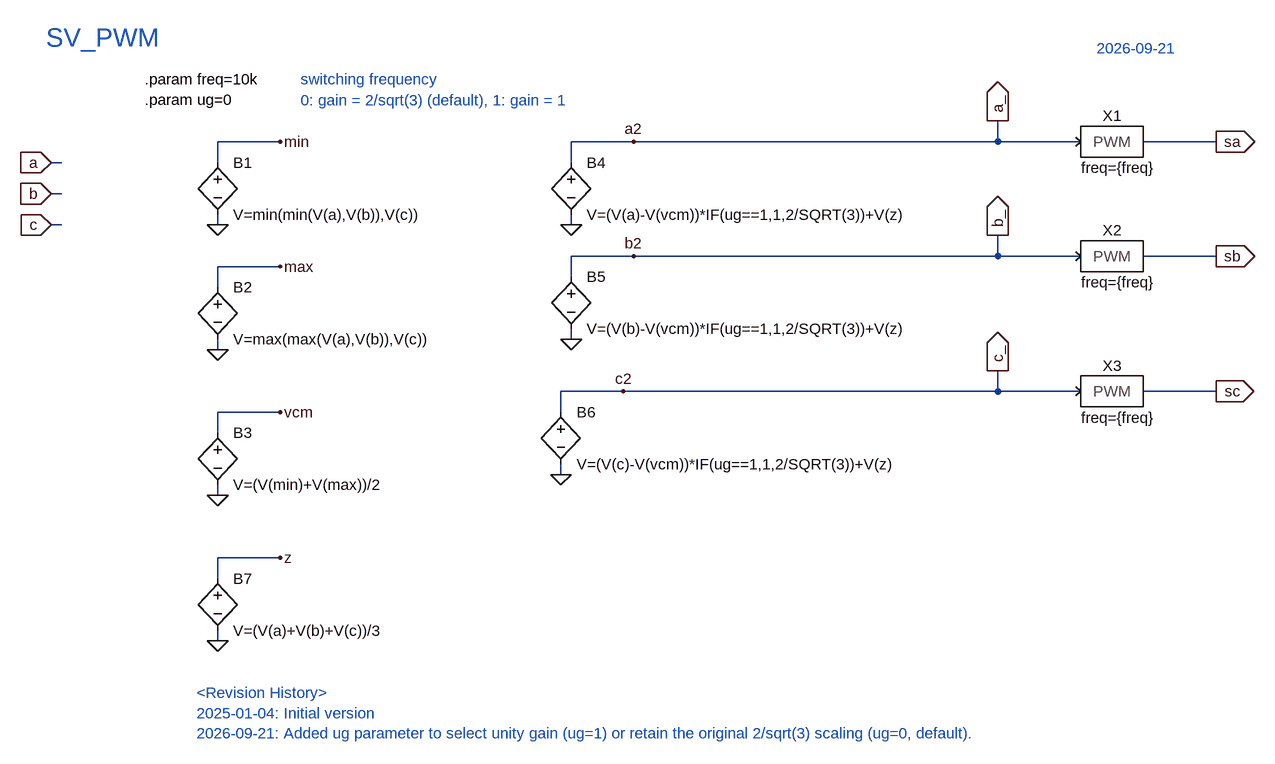
[diagram p0: schematic SV_PWM.asc]
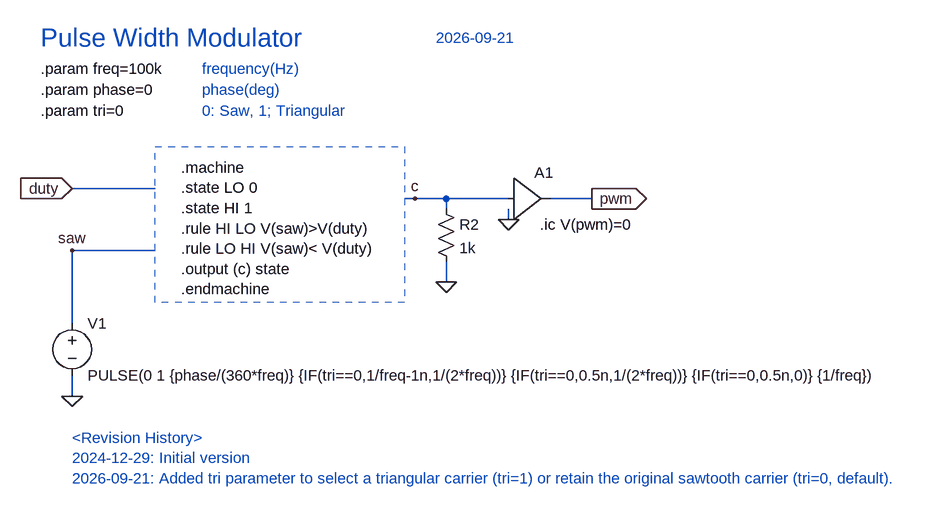
[diagram p1: sub-circuit pwm.asc]
SV_PWM.asc, the LTspice schematic file:
Version 4.1
SHEET 1 2540 1384
WIRE 720 464 624 464
WIRE 1264 464 1168 464
WIRE 1824 464 1824 432
WIRE 1824 464 1264 464
WIRE 1952 464 1824 464
WIRE 2160 464 2048 464
WIRE 384 496 368 496
WIRE 624 496 624 464
WIRE 1168 496 1168 464
WIRE 384 544 368 544
WIRE 384 592 368 592
WIRE 624 592 624 576
WIRE 1168 592 1168 576
WIRE 1264 640 1168 640
WIRE 1824 640 1824 608
WIRE 1824 640 1264 640
WIRE 1952 640 1824 640
WIRE 2160 640 2048 640
WIRE 720 656 624 656
WIRE 1168 672 1168 640
WIRE 624 688 624 656
WIRE 1168 768 1168 752
WIRE 624 784 624 768
WIRE 1248 848 1152 848
WIRE 1824 848 1824 816
WIRE 1824 848 1248 848
WIRE 1952 848 1824 848
WIRE 2160 848 2048 848
WIRE 720 880 624 880
WIRE 1152 880 1152 848
WIRE 624 912 624 880
WIRE 1152 976 1152 960
WIRE 624 1008 624 992
WIRE 720 1104 624 1104
WIRE 624 1136 624 1104
WIRE 624 1232 624 1216
FLAG 368 496 a
IOPIN 368 496 In
FLAG 368 544 b
IOPIN 368 544 In
FLAG 368 592 c
IOPIN 368 592 In
FLAG 624 592 0
FLAG 720 464 min
FLAG 624 784 0
FLAG 720 656 max
FLAG 624 1008 0
FLAG 720 880 vcm
FLAG 1168 592 0
FLAG 1264 464 a2
FLAG 1168 768 0
FLAG 1264 640 b2
FLAG 1152 976 0
FLAG 1248 848 c2
FLAG 624 1232 0
FLAG 720 1104 z
FLAG 2160 464 sa
IOPIN 2160 464 Out
FLAG 2160 640 sb
IOPIN 2160 640 Out
FLAG 2160 848 sc
IOPIN 2160 848 Out
FLAG 1824 432 a_
IOPIN 1824 432 Out
FLAG 1824 608 b_
IOPIN 1824 608 Out
FLAG 1824 816 c_
IOPIN 1824 816 Out
SYMBOL bv 624 480 R0
SYMATTR InstName B1
SYMATTR Value V=min(min(V(a),V(b)),V(c))
SYMBOL bv 624 672 R0
SYMATTR InstName B2
SYMATTR Value V=max(max(V(a),V(b)),V(c))
SYMBOL bv 624 896 R0
SYMATTR InstName B3
SYMATTR Value V=(V(min)+V(max))/2
SYMBOL bv 1168 480 R0
SYMATTR InstName B4
SYMATTR Value V=(V(a)-V(vcm))*IF(ug==1,1,2/SQRT(3))+V(z)
SYMBOL bv 1168 656 R0
SYMATTR InstName B5
SYMATTR Value V=(V(b)-V(vcm))*IF(ug==1,1,2/SQRT(3))+V(z)
SYMBOL bv 1152 864 R0
SYMATTR InstName B6
SYMATTR Value V=(V(c)-V(vcm))*IF(ug==1,1,2/SQRT(3))+V(z)
SYMBOL bv 624 1120 R0
SYMATTR InstName B7
SYMATTR Value V=(V(a)+V(b)+V(c))/3
SYMBOL PowerSim\\PWM 2000 464 R0
WINDOW 39 10 56 Bottom 2
SYMATTR SpiceLine freq={freq}
SYMATTR InstName X1
SYMBOL PowerSim\\PWM 2000 640 R0
WINDOW 39 10 56 Bottom 2
SYMATTR SpiceLine freq={freq}
SYMATTR InstName X2
SYMBOL PowerSim\\PWM 2000 848 R0
WINDOW 39 10 56 Bottom 2
SYMATTR SpiceLine freq={freq}
SYMATTR InstName X3
TEXT 360 304 Left 4 ;SV_PWM
TEXT 1976 320 Left 2 ;2026-09-21
TEXT 512 368 Left 2 !.param freq=10k\n.param ug=0
TEXT 752 368 Left 2 ;switching frequency
TEXT 752 400 Left 2 ;0: gain = 2/sqrt(3) (default), 1: gain = 1
TEXT 592 1312 Left 2 ;<Revision History>\n2025-01-04: Initial version\n2026-09-21: Added ug parameter to select unity gain (ug=1) or retain the original 2/sqrt(3) scaling (ug=0, default).

pwm.asc, the sub-circuit schematic file:
Version 4.1
SHEET 1 1668 1312
WIRE 32 64 -96 64
WIRE 432 80 416 80
WIRE 480 80 432 80
WIRE 576 80 480 80
WIRE 704 80 640 80
WIRE 480 96 480 80
WIRE 576 112 576 96
WIRE 32 160 -96 160
WIRE 480 208 480 176
WIRE -96 272 -96 160
WIRE -96 384 -96 352
FLAG -96 64 duty
IOPIN -96 64 In
FLAG 704 80 pwm
IOPIN 704 80 Out
FLAG 480 208 0
FLAG 432 80 c
FLAG 576 112 0
FLAG -96 384 0
FLAG -96 160 saw
SYMBOL res 464 80 R0
SYMATTR InstName R2
SYMATTR Value 1k
SYMBOL Digital\\buf1 576 16 R0
SYMATTR InstName A1
SYMBOL voltage -96 256 R0
WINDOW 123 0 0 Left 0
WINDOW 39 0 0 Left 0
SYMATTR InstName V1
SYMATTR Value PULSE(0 1 {phase/(360*freq)} {IF(tri==0,1/freq-1n,1/(2*freq))} {IF(tri==0,0.5n,1/(2*freq))} {IF(tri==0,0.5n,0)} {1/freq})
TEXT 72 32 Left 2 !.machine\n.state LO 0\n.state HI 1\n.rule HI LO V(saw)>V(duty)\n.rule LO HI V(saw)< V(duty)\n.output (c) state\n.endmachine
TEXT -144 -120 Left 2 !.param freq=100k
TEXT 624 120 Left 2 !.ic V(pwm)=0
TEXT -144 -88 Left 2 !.param phase=0
TEXT -144 -168 Left 4 ;Pulse Width Modulator
TEXT 464 -168 Left 2 ;2026-09-21
TEXT 104 -120 Left 2 ;frequency(Hz)
TEXT -144 -56 Left 2 !.param tri=0
TEXT 104 -56 Left 2 ;0: Saw, 1; Triangular
TEXT 104 -88 Left 2 ;phase(deg)
TEXT -96 448 Left 2 ;<Revision History>\n2024-12-29: Initial version\n2026-09-21: Added tri parameter to select a triangular carrier (tri=1) or retain the original sawtooth carrier (tri=0, default).
RECTANGLE Normal 416 240 32 0 2

The netlist it stands for:
* SV_PWM.asc
B1 min 0 V=min(min(V(a),V(b)),V(c))
B2 max 0 V=max(max(V(a),V(b)),V(c))
B3 vcm 0 V=(V(min)+V(max))/2
B4 a_ 0 V=(V(a)-V(vcm))*IF(ug==1,1,2/SQRT(3))+V(z)
B5 b_ 0 V=(V(b)-V(vcm))*IF(ug==1,1,2/SQRT(3))+V(z)
B6 c_ 0 V=(V(c)-V(vcm))*IF(ug==1,1,2/SQRT(3))+V(z)
B7 z 0 V=(V(a)+V(b)+V(c))/3
X§X1 a_ sa pwm params: tri=0 freq={freq} phase=0
X§X2 b_ sb pwm params: tri=0 freq={freq} phase=0
X§X3 c_ sc pwm params: tri=0 freq={freq} phase=0

* block symbol definitions
.subckt pwm duty pwm
R2 c 0 1k
A1 c 0 0 0 0 0 pwm 0 BUF
V1 saw 0 PULSE(0 1 {phase/(360*freq)} {IF(tri==0,1/freq-1n,1/(2*freq))} {IF(tri==0,0.5n,1/(2*freq))} {IF(tri==0,0.5n,0)} {1/freq})
.machine
.state LO 0
.state HI 1
.rule HI LO V(saw)>V(duty)
.rule LO HI V(saw)< V(duty)
.output (c) state
.endmachine
.param freq=100k
.ic V(pwm)=0
.param phase=0
* Pulse Width Modulator
* 2026-09-21
* frequency(Hz)
.param tri=0
* 0: Saw, 1; Triangular
* phase(deg)
* <Revision History>
* 2024-12-29: Initial version
* 2026-09-21: Added tri parameter to select a triangular carrier (tri=1) or retain the original sawtooth carrier (tri=0, default).
.ends pwm

* SV_PWM
* 2026-09-21
.param freq=10k
.param ug=0
* switching frequency
* 0: gain = 2/sqrt(3) (default), 1: gain = 1
* <Revision History>
* 2025-01-04: Initial version
* 2026-09-21: Added ug parameter to select unity gain (ug=1) or retain the original 2/sqrt(3) scaling (ug=0, default).
.backanno
.end